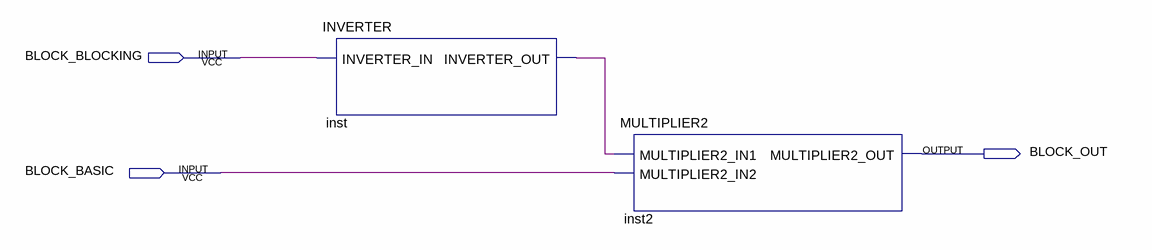
[diagram p0: schematic sheet]
// Quartus schematic BLOCK.bdf as structural Verilog: 2 symbols, 3 pins
module BLOCK (
  input  BLOCK_BLOCKING,
  input  BLOCK_BASIC,
  output BLOCK_OUT
);

  wire inst_inverter_out;

  INVERTER inst (.INVERTER_IN(BLOCK_BLOCKING), .INVERTER_OUT(inst_inverter_out));
  MULTIPLIER2 inst2 (.MULTIPLIER2_IN1(inst_inverter_out), .MULTIPLIER2_IN2(BLOCK_BASIC), .MULTIPLIER2_OUT(BLOCK_OUT));
endmodule
